# Altium schematic sheet ISCP.SchDoc
size A
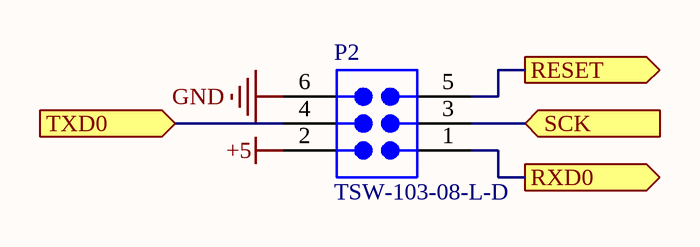
[diagram p0: ISCP.SchDoc]

## Parts
P2  TSW-103-08-L-D  [SMTC-TSW-103-08-X-D]

## Ports
RESET (out), RXD0 (out), SCK (in), TXD0 (in)

## Nets
+5: P2.2
GND: P2.6
RESET: P2.5 ; port RESET
RXD0: P2.1 ; port RXD0
SCK: P2.3 ; port SCK
TXD0: P2.4 ; port TXD0

## Library data of the parts
P2 = CMP-1024-00336-1: 0.025" SQ Post Header, Through-hole, Vertical, -55 to 125 degC, 2.54 mm Pitch, 6-Pin, Male, RoHS; Manufacturer: Samtec; Pitch: 2.54 mm; PackageVersion: DM, 8/1988; ComponentLink3Description: Package Specification; ComponentLink2Description: Datasheet; RoHS: True; ComponentLink1URL: http://www.samtec.com; PackageDescription: .025[0.64] SQ. Post Terminal Strip Assembly; PackageReference: TSW-103-08-X-D; Mounting Technology: Through-hole; DatasheetVersion: F-214; ComponentLink1Description: Manufacturer URL; Temperature Range: -55 to 125 degC; ComponentLink2URL: http://www.samtec.com/documents/webfiles/pdf/TSW_TH.PDF; ComponentLink3URL: http://www.samtec.com/documents/webfiles/cpdf/TSW-XXX-XX-XXX-X-XX-XXX-MKT.pdf; PartNumber: TSW-103-08-L-D; Orientation: Vertical